# EAGLE schematic PowerSupply (EAGLE 7.2.0)
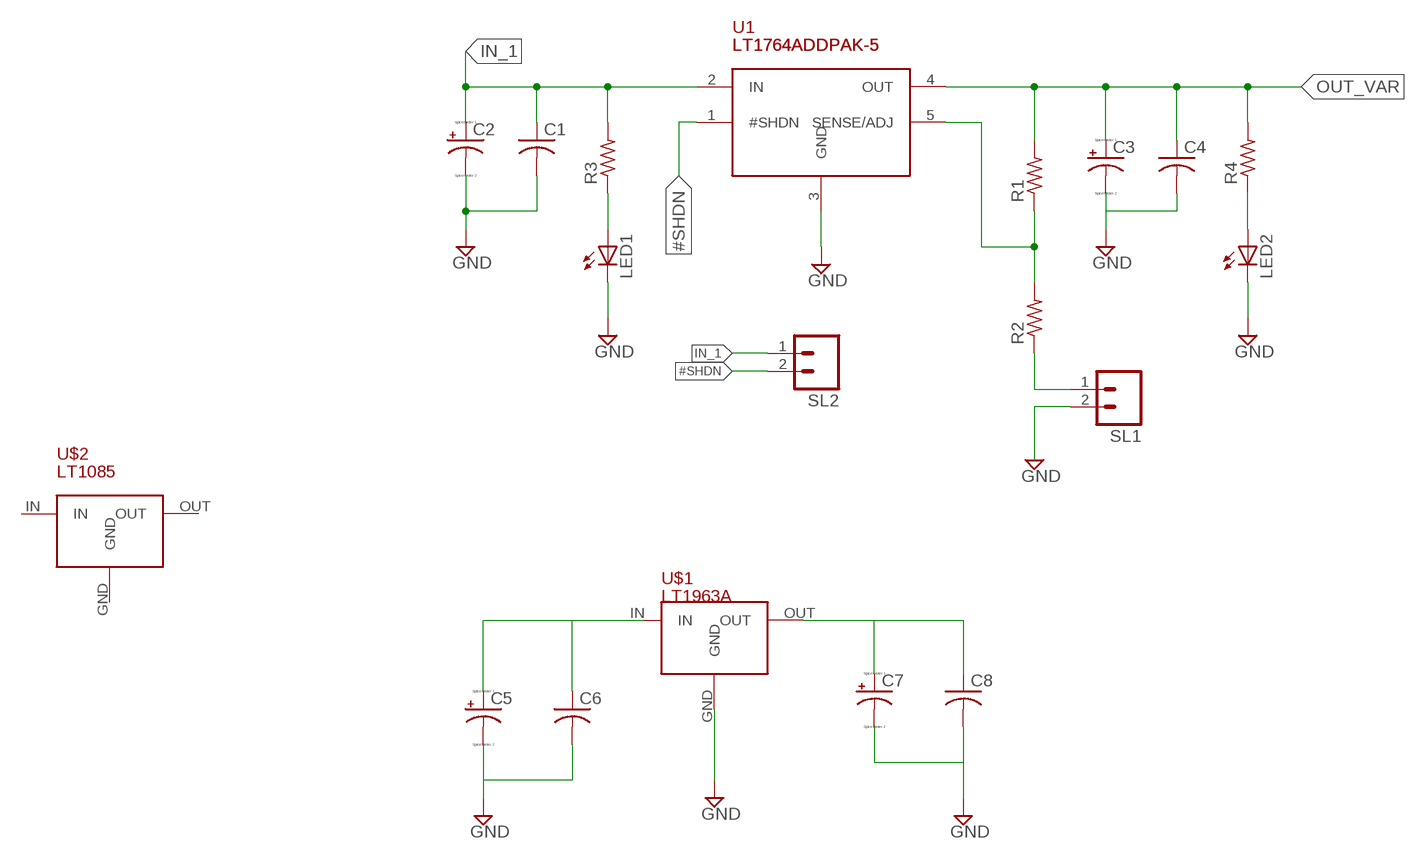
[diagram p0: schematic, sheet 1]

## Parts
C1  C-USC1206  [C1206]
C2  CPOL-US153CLV-0810  [153CLV-0810]
C3  CPOL-US153CLV-0810  [153CLV-0810]
C4  C-USC1206  [C1206]
C5  CPOL-US153CLV-0810  [153CLV-0810]
C6  C-USC1206  [C1206]
C7  CPOL-US153CLV-0810  [153CLV-0810]
C8  C-USC1206  [C1206]
LED1  LEDCHIP-LED0805  [CHIP-LED0805]
LED2  LEDCHIP-LED0805  [CHIP-LED0805]
R1  R-US_R1206  [R1206]
R2  R-US_R1206  [R1206]
R3  R-US_R1206  [R1206]
R4  R-US_R1206  [R1206]
SL1  M02  [02P]
SL2  M02  [02P]
U1  LT1764ADDPAK-5  [DD-5]
U$1  LT1963A  [ST-3]
U$2  LT1085  [DD-3]

## Nets
#SHDN: SL2.2 U1.1(#SHDN)
GND: C1.2 C2.- C3.- C4.2 C5.- C6.2 C7.- C8.2 LED1.C LED2.C U1.3(GND) U$1.GND
IN_1: C1.1 C2.+ R3.2 SL2.1 U1.2(IN)
N$1: LED2.A R4.1
N$2: R1.1 R2.2 U1.5(SENSE/ADJ)
N$3: R2.1 SL1.1
N$4: SL1.2
N$5: C5.+ C6.1
N$6: LED1.A R3.1
N$8: C7.+ C8.1 U$1.OUT
OUT_VAR: C3.+ C4.1 R1.2 R4.2 U1.4(OUT)
Unconnected: U$1.IN U$2.GND U$2.IN U$2.OUT

## Library data of the parts
C1 C4 C6 C8 = resistor:C-US: CAPACITOR, American symbol
C2 C3 C5 C7 = resistor:CPOL-US: POLARIZED CAPACITOR, American symbol
LED1 LED2 = led:LED: LED OSRAM: - CHIPLED LG R971, LG N971, LY N971, LG Q971, LY Q971, LO R971, LY R971 LH N974, LH R974 LS Q976, LO Q976, LY Q976 LO Q996 - Hyper CHIPLED LW Q18S LB Q993, LB Q99A, LB R99A - SideLED LS A670, LO A670, LY A670, LG A670, LP A670 LB A673, LV A673, LT A673, LW A673 LH A674 LY A675 LS A676, LA A676, LO A676, LY A676, LW A676 LS A679, LY A679, LG A679 - Hyper Micro SIDELED® LS Y876, LA Y876, LO Y876, LY Y876 LT Y87S - SmartLED LW L88C, LW L88S LB L89C, LB L89S, LG L890 LS L89K, LO L89K, LY L89K LS L896, LA L896, LO L896, LY L896 - TOPLED LS T670, LO T670, LY T670, LG T670, LP T670 LSG T670, LSP T670, LSY T670, LOP T670, LYG T670 LG T671, LOG T671, LSG T671 LB T673, LV T673, LT T673, LW T673 LH T674 LS T676, LA T676, LO T676, LY T676, LB T676, LH T676, LSB T676, LW T676 LB T67C, LV T67C, LT T67C, LS T67K, LO T67K, LY T67K, LW E67C LS E67B, LA E67B, LO E67B, LY E67B, LB E67C, LV E67C, LT E67C LW T67C LS T679, LY T679, LG T679 LS T770, LO T770, LY T770, LG T770, LP T770 LB T773, LV T773, LT T773, LW T773 LH T774 LS E675, LA E675, LY E675, LS T675 LS T776, LA T776, LO T776, LY T776, LB T776 LHGB T686 LT T68C, LB T68C - Hyper Mini TOPLED® LB M676 - Mini TOPLED Santana® LG M470 LS M47K, LO M47K, LY M47K Source: http://www.osram.convergy.de LUXEON: - LUMILED® LXK2-PW12-R00, LXK2-PW12-S00, LXK2-PW14-U00, LXK2-PW14-V00 LXK2-PM12-R00, LXK2-PM12-S00, LXK2-PM14-U00 LXK2-PE12-Q00, LXK2-PE12-R00, LXK2-PE12-S00, LXK2-PE14-T00, LXK2-PE14-U00 LXK2-PB12-K00, LXK2-PB12-L00, LXK2-PB12-M00, LXK2-PB14-N00, LXK2-PB14-P00, LXK2-PB14-Q00 LXK2-PR12-L00, LXK2-PR12-M00, LXK2-PR14-Q00, LXK2-PR14-R00 LXK2-PD12-Q00, LXK2-PD12-R00, LXK2-PD12-S00 LXK2-PH12-R00, LXK2-PH12-S00 LXK2-PL12-P00, LXK2-PL12-Q00, LXK2-PL12-R00 Source: www.luxeon.com KINGBRIGHT: KA-3528ASYC Source: www.kingbright.com
R1-R4 = resistor:R-US_: RESISTOR, American symbol
SL1 SL2 = con-amp-quick:M02: AMP QUICK CONNECTOR; OC_FARNELL: unknown; OC_NEWARK: unknown
U1 = HCloudLib:LT1764A
U$1 = HCloudLib:LT1963A
U$2 = HCloudLib:LT1085